# EAGLE design imsensor-esp-v01 (EAGLE 7.5.0)
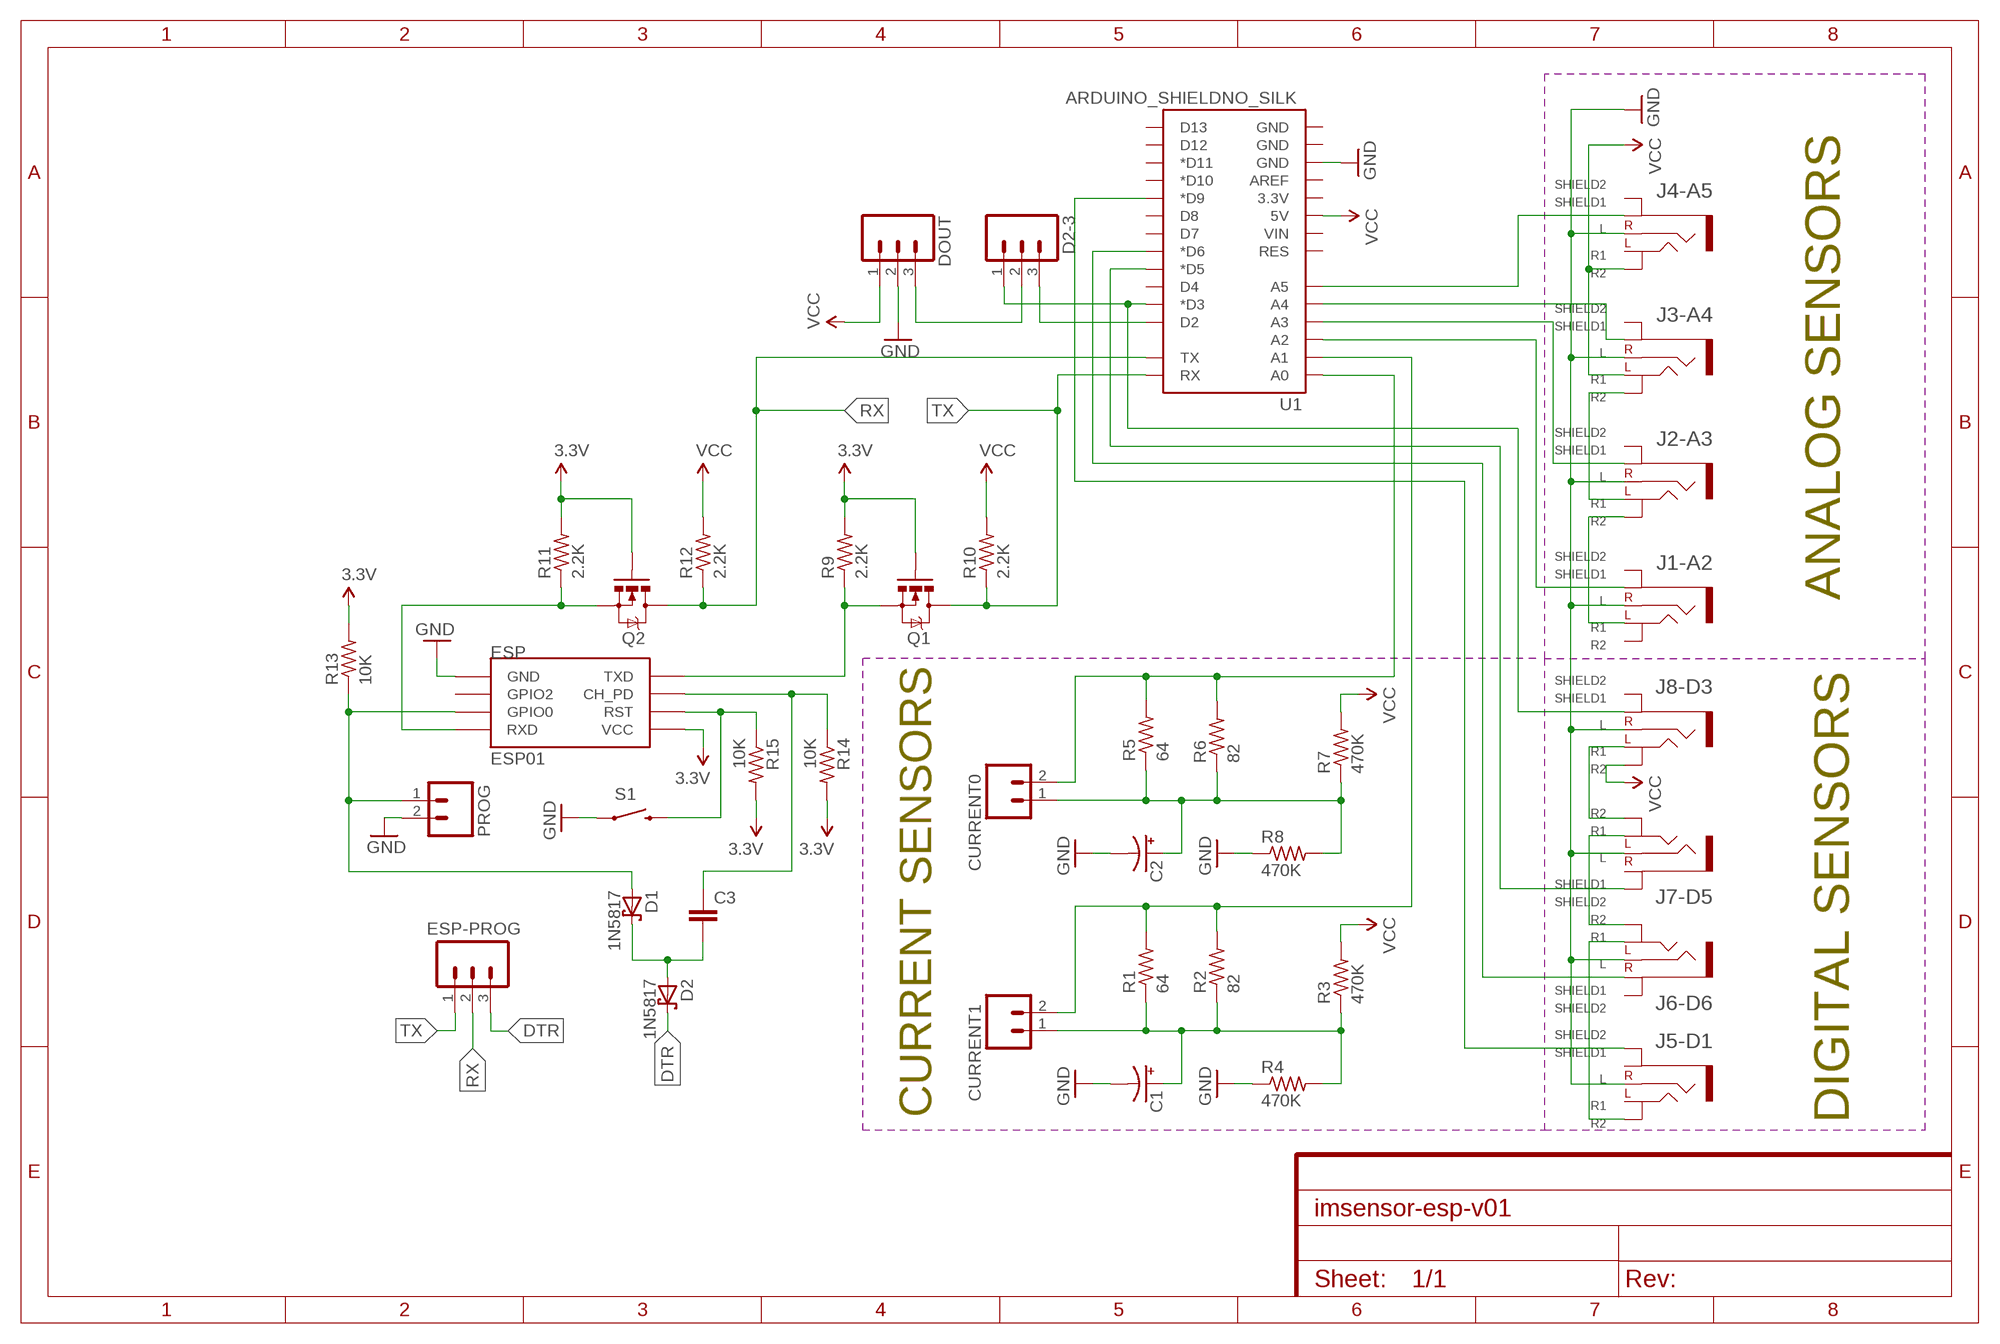
[diagram p0: schematic, sheet 1]
FRAME1 (FRAME-A4L): CNAME: IMSensorNode; CREVISION: REV A; DESIGNER: Jeferson Lima

## Parts
C1  10UF-25V-20%(PTH)  [CPOL-RADIAL-10UF-25V]
C2  10UF-25V-20%(PTH)  [CPOL-RADIAL-10UF-25V]
C3  CAPPTH  [CAP-PTH-SMALL]
CURRENT0  M02PTH  [1X02]
CURRENT1  M02PTH  [1X02]
D1  1N5817  SCHOTTKY-DIODEDO35-7  [DO35-7]
D2  1N5817  SCHOTTKY-DIODEDO35-7  [DO35-7]
D2-3  M03PTH  [1X03]
DOUT  M03PTH  [1X03]
ESP  ESP01  [ESP01]
ESP-PROG  M03PTH  [1X03]
J1-A2  PJ-313-SPAD  [PJ-313-5PIN-SMALL]
J2-A3  PJ-313-SPAD  [PJ-313-5PIN-SMALL]
J3-A4  PJ-313-SPAD  [PJ-313-5PIN-SMALL]
J4-A5  PJ-313-SPAD  [PJ-313-5PIN-SMALL]
J5-D1  PJ-313-SPAD  [PJ-313-5PIN-SMALL]
J6-D6  PJ-313-SPAD  [PJ-313-5PIN-SMALL]
J7-D5  PJ-313-SPAD  [PJ-313-5PIN-SMALL]
J8-D3  PJ-313-SPAD  [PJ-313-5PIN-SMALL]
PROG  M02PTH  [1X02]
Q1  MOSFET-NCHANNEL2N7000  [TO-92]
Q2  MOSFET-NCHANNEL2N7000  [TO-92]
R1  64  R-US_0207/10  [0207/10]
R2  82  R-US_0207/10  [0207/10]
R3  470K  R-US_0207/10  [0207/10]
R4  470K  R-US_0207/10  [0207/10]
R5  64  R-US_0207/10  [0207/10]
R6  82  R-US_0207/10  [0207/10]
R7  470K  R-US_0207/10  [0207/10]
R8  470K  R-US_0207/10  [0207/10]
R9  2.2K  R-US_0207/10  [0207/10]
R10  2.2K  R-US_0207/10  [0207/10]
R11  2.2K  R-US_0207/10  [0207/10]
R12  2.2K  R-US_0207/10  [0207/10]
R13  10K  R-US_0207/10  [0207/10]
R14  10K  R-US_0207/10  [0207/10]
R15  10K  R-US_0207/10  [0207/10]
S1  SWITCH-MOMENTARY-2PTH  [TACTILE-PTH]
U1  ARDUINO_SHIELDNO_SILK  [DUEMILANOVE_VIAS]

## Nets
3.3V: ESP.VCC Q1.2(G) Q2.2(G) R9.2 R11.2 R13.2 R14.2 R15.2
DEK: CURRENT0.2 R5.2 R6.2 U1.A0
DTR: D2.C ESP-PROG.3
GND: C1.2(-) C2.2(-) DOUT.2 ESP.GND J1-A2.2(R) J2-A3.2(R) J3-A4.2(R) J4-A5.2(R) J5-D1.2(R) J6-D6.2(R) J7-D5.2(R) J8-D3.2(R) PROG.2 R4.1 R8.1 S1.1 U1.GND@2(GND)
J5: J6-D6.1.1(SHIELD1) U1.D6(*D6)
N$1: J2-A3.3.1(L1) J3-A4.3.2(L2)
N$2: J1-A2.3.1(L1) J2-A3.3.2(L2)
N$3: J3-A4.1.1(SHIELD1) U1.A4
N$4: J2-A3.1.1(SHIELD1) U1.A3
N$5: J1-A2.1.1(SHIELD1) U1.A2
N$6: J7-D5.1.2(SHIELD2) U1.D5(*D5)
N$7: J7-D5.3.2(L2) J8-D3.3.1(L1)
N$8: D2-3.2 DOUT.3
N$9: J6-D6.3.2(L2) J7-D5.3.1(L1)
N$10: CURRENT1.2 R1.2 R2.2 U1.A1
N$11: C1.1(+) CURRENT1.1 R1.1 R2.1 R3.1 R4.2
N$12: J5-D1.1.2(SHIELD2) U1.D9(*D9)
N$13: D2-3.1 J8-D3.1.1(SHIELD1) U1.D3(*D3)
N$14: D2-3.3 U1.D2
N$15: J4-A5.1.1(SHIELD1) U1.A5
N$16: J5-D1.3.2(L2) J6-D6.3.1(L1)
N$17: C2.1(+) CURRENT0.1 R5.1 R6.1 R7.1 R8.2
N$18: ESP.TX(TXD) Q1.1(S) R9.1
N$20: ESP.RST R15.1 S1.3
N$21: ESP.RX(RXD) Q2.1(S) R11.1
N$22: C3.1 ESP.CH_PD R14.1
N$25: D1.A ESP.GPIO0 PROG.1 R13.1
RX: ESP-PROG.2 Q2.3(D) R12.1 U1.TX
TX: ESP-PROG.1 Q1.3(D) R10.1 U1.RX
U$1: C3.2 D1.C D2.A
VCC: DOUT.1 J3-A4.3.1(L1) J4-A5.3.2(L2) J8-D3.3.2(L2) R3.2 R7.2 R10.2 R12.2 U1.5V
Unconnected: ESP.GPIO2 J1-A2.1.2(SHIELD2) J1-A2.3.2(L2) J2-A3.1.2(SHIELD2) J3-A4.1.2(SHIELD2) J4-A5.1.2(SHIELD2) J4-A5.3.1(L1) J5-D1.1.1(SHIELD1) J5-D1.3.1(L1) J6-D6.1.2(SHIELD2) J7-D5.1.1(SHIELD1) J8-D3.1.2(SHIELD2) U1.3.3V U1.AREF U1.D4 U1.D7 U1.D8 U1.D10(*D10) U1.D11(*D11) U1.D12 U1.D13 U1.GND@0(GND) U1.GND@1(GND) U1.RES U1.VIN

## Notes on the sheet
- ANALOG SENSORS
- CURRENT SENSORS | DIGITAL SENSORS

## Library data of the parts
C1 C2 = SparkFun-Capacitors:10UF-25V-20%(PTH): CAP-08440; PROD_ID: CAP-08440
C3 = SparkFun-Capacitors:CAP: Capacitor Standard 0603 ceramic capacitor, and 0.1" leaded capacitor.
CURRENT0 CURRENT1 PROG = SparkFun-Connectors:M02: Standard 2-pin 0.1" header. Use with - straight break away headers ( PRT-00116) - right angle break away headers (PRT-00553) - swiss pins (PRT-00743) - machine pins (PRT-00117) - female headers (PRT-00115) Molex polarized connector foot print use with: PRT-08233 with associated crimp pins and housings. 2.54_SCREWTERM for use with PRT-10571. 3.5mm Screw Terminal footprints for PRT-08084 5mm Screw Terminal footprints for use with PRT-08432
D1 D2 = adafruit:SCHOTTKY-DIODE: Schottky Diode
D2-3 DOUT ESP-PROG = SparkFun-Connectors:M03: Header 3 Standard 3-pin 0.1" header. Use with straight break away headers (SKU : PRT-00116), right angle break away headers (PRT-00553), swiss pins (PRT-00743), machine pins (PRT-00117), and female headers (PRT-00115). Molex polarized connector foot print use with SKU : PRT-08232 with associated crimp pins and housings.
ESP = esp8266-modules:ESP01: ESP8266 Wifi module 01
J1-A2 J2-A3 J3-A4 J4-A5 J5-D1 J6-D6 J7-D5 J8-D3 = salvador-parts:PJ-313-SPAD: PJ-313 with octagon pads PJ-313 with small octagon pads, good for projects which need small footprints
Q1 Q2 = SparkFun-DiscreteSemi:MOSFET-NCHANNEL: Common NMOSFET Parts MFG P/N Store ID Prod ID FDD8780 TRANS-09984 SI7820DN TRANS-11055 FDS6630A IC-08089 2N7002PW TRANS-11151 FQP30N06L COM-10213 TRANS-10060 BSS123LT1G TRANS-08345 BSS138 TRANS-00830 BS170 2N7000
R1-R15 = resistor:R-US_: RESISTOR, American symbol
S1 = SparkFun-Electromechanical:SWITCH-MOMENTARY-2: Various NO switches- pushbuttons, reed, etc; PROD_ID: SWCH-08441
U1 = SparkFun-Boards:ARDUINO_SHIELD: Arduino shield footprint

## Board
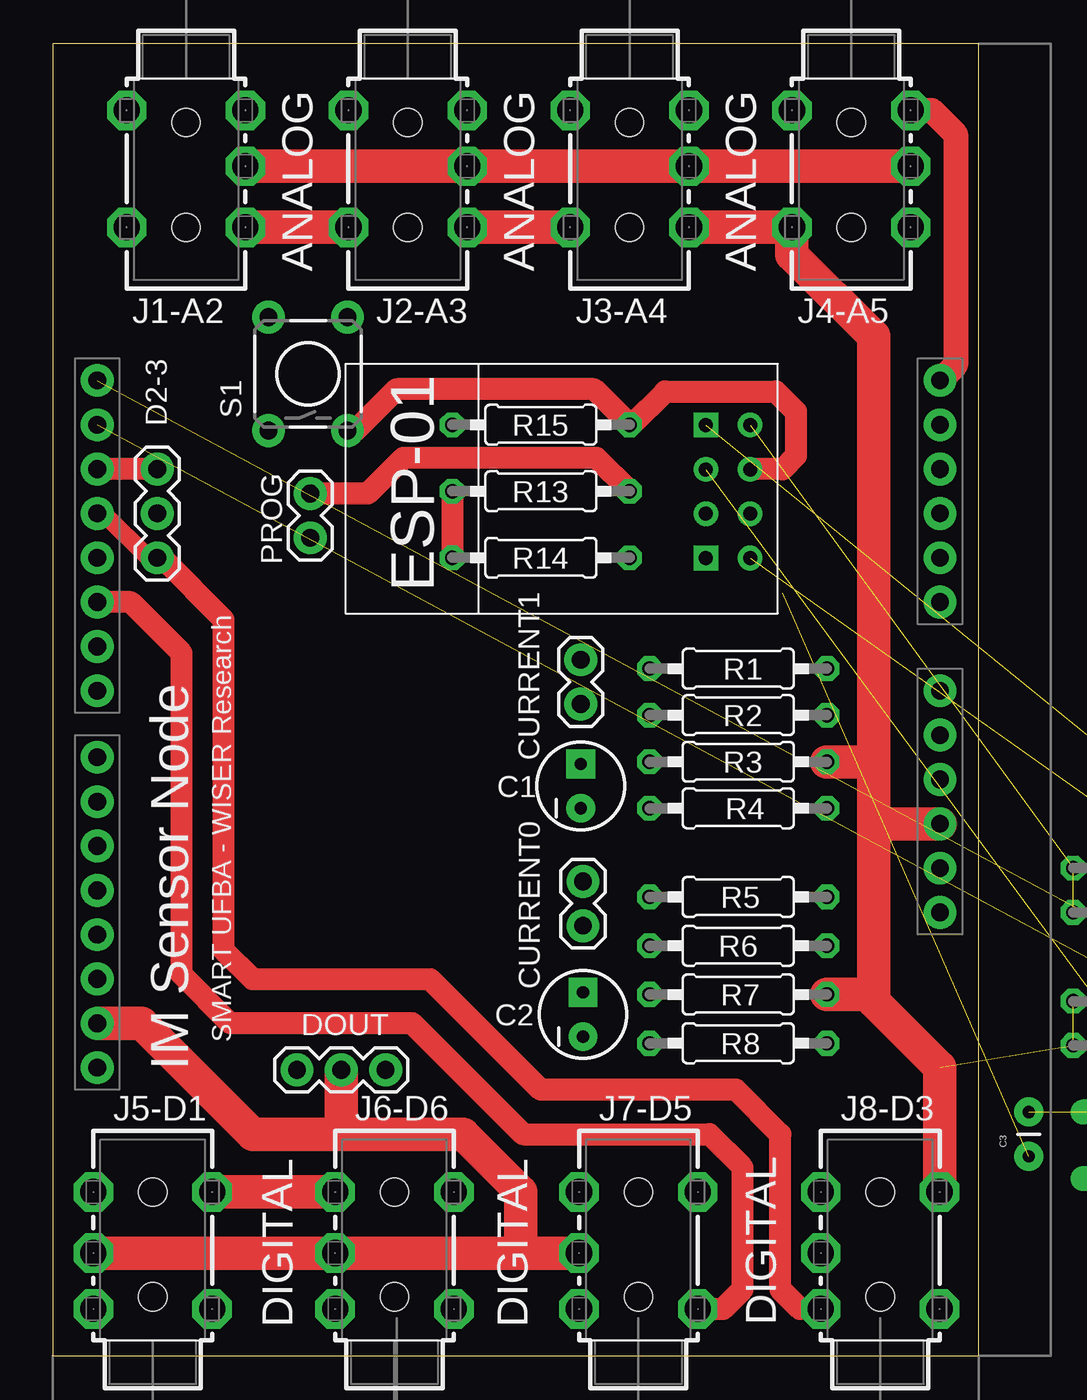
[diagram p1: board, top side]
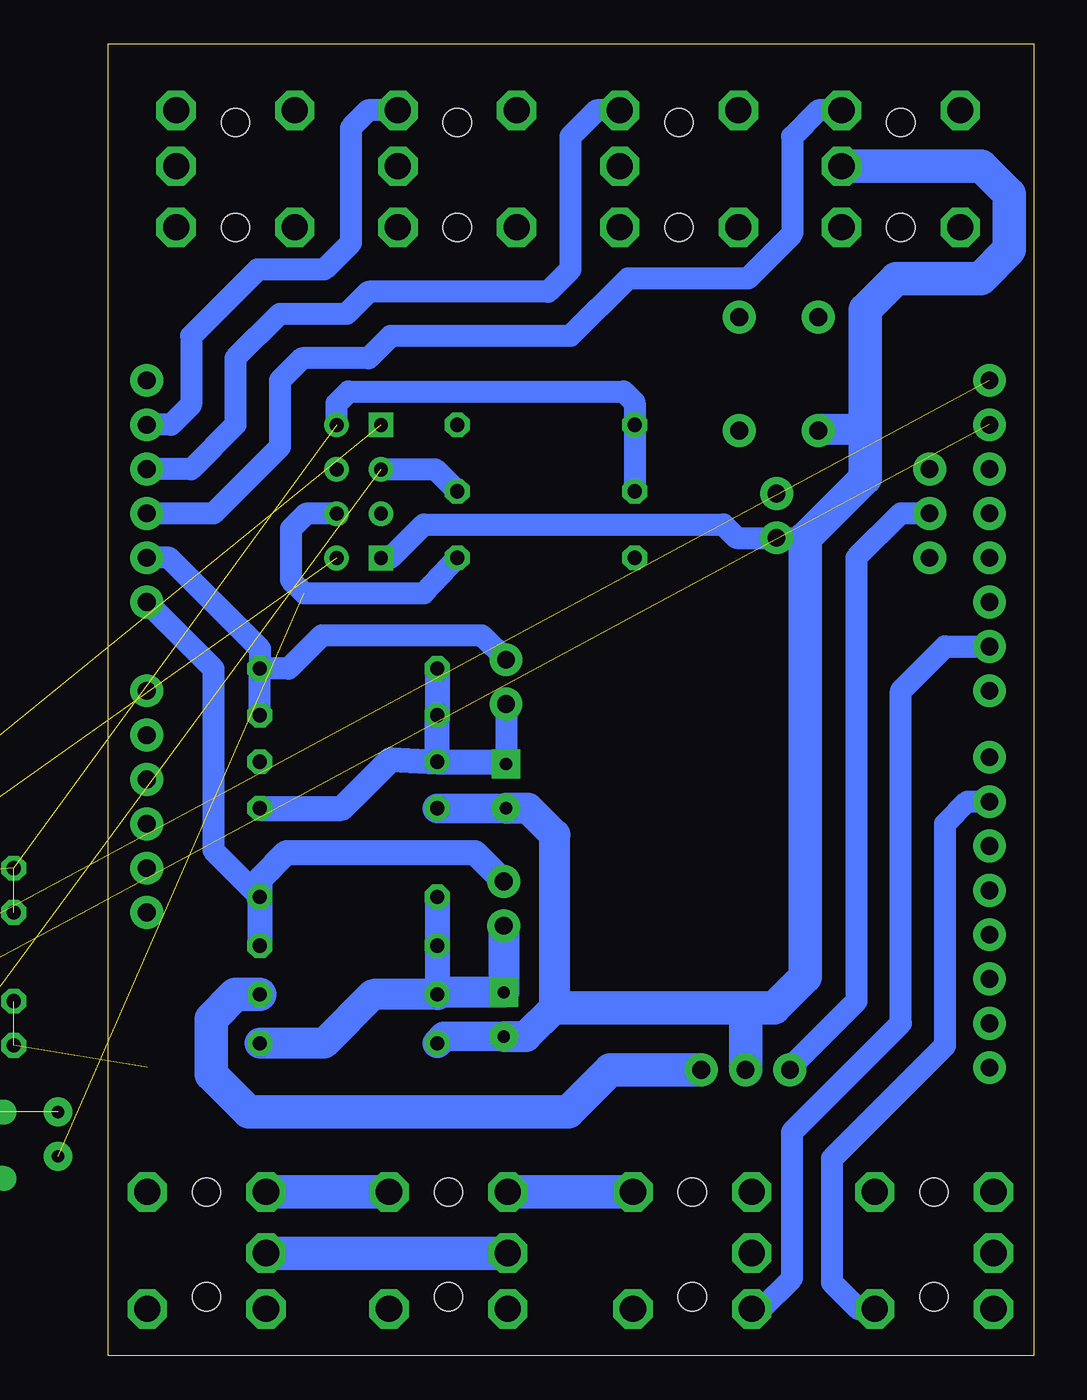
[diagram p2: board, bottom side, seen from below]

Size 53.01 x 75.17 mm. Coordinates in mm from the lower left corner, seen from the top.
Outline: 0,0 53.01,0 53.01,75.17 0,75.17 0,0
Copper layers (1*16): Top 0.035mm / dielectric 1.5mm / Bottom 0.035mm
Design rules "default": minimum track width 8mil, minimum drill 20mil, track to track 8mil, track to pad 8mil, pad to pad 8mil, via to via 8mil, smd to smd 8mil, copper to edge 10mil, drill to drill 8mil, minimum pad ring 12mil, minimum via ring 10mil, stop-mask expansion 4mil, vias tented up to drill 25mil, thermal gap 10mil

### Footprints (pad centres in the part's own frame; a part is rotated, then mirrored left to right if it is on the bottom)
CPOL-RADIAL-10UF-25V = drill 0.7 pad 1.651 square: 1 1.27,0 | drill 0.7 pad 1.651: 2 -1.27,0
CAP-PTH-SMALL = drill 0.7 pad 1.651: 1 0,0; 2 2.54,0
1X02 = drill 1.016 pad 1.88: 1 0,0; 2 2.54,0
DO35-7 = drill 0.813 long: A 3.81,0; C -3.81,0
1X03 = drill 1.016 pad 1.88: 1 0,0; 2 2.54,0; 3 5.08,0
ESP01 = drill 0.8: CH_PD -1.285,-8.178; GPIO0 1.255,-5.638; GPIO2 -1.285,-5.638; RST 1.255,-8.178; TX -3.825,-8.178; VCC 3.795,-8.178 | drill 0.8 square: GND -3.825,-5.638; RX 3.795,-5.638
PJ-313-5PIN-SMALL = drill 1.5 octagon: 1.1 1.8,3.4; 1.2 1.8,-3.4; 2 5,3.4; 3.1 8.5,3.4; 3.2 8.5,-3.4 | hole 1.6: 2.5,0; 8.5,0
TO-92 = drill 0.813 pad 1.88: 1 -1.27,0; 2 0,1.905; 3 1.27,0
0207/10 = drill 0.813 octagon: 1 -5.08,0; 2 5.08,0
TACTILE-PTH = drill 1.016 pad 1.88: 1 -3.251,2.261; 2 3.251,2.261; 3 -3.251,-2.261; 4 3.251,-2.261
DUEMILANOVE_VIAS = drill 1.016 pad 1.88: 3.3V 50.8,13.97; 5V 50.8,16.51; A0 50.8,29.21; A1 50.8,31.75; A2 50.8,34.29; A3 50.8,36.83; A4 50.8,39.37; A5 50.8,41.91; AREF 2.54,2.54; D2 2.54,36.83; D3 2.54,34.29; D4 2.54,31.75; D5 2.54,29.21; D6 2.54,26.67; D7 2.54,24.13; D8 2.54,20.32; D9 2.54,17.78; D10 2.54,15.24; D11 2.54,12.7; D12 2.54,10.16; D13 2.54,7.62; GND@0 50.8,19.05; GND@1 50.8,21.59; GND@2 2.54,5.08; RES 50.8,11.43; RX 2.54,41.91; TX 2.54,39.37; VIN 50.8,24.13

### Placement (x,y rotation side)
C1  30.23,32.64 90 top
C2  30.35,19.56 90 top
C3  55.88,11.43 90 top
CURRENT0  30.35,24.64 90 top
CURRENT1  30.23,37.34 90 top
D1  63.5,10.16 0 top  (outside the outline)
D2  63.5,13.97 180 top  (outside the outline)
D2-3  5.97,45.72 90 top
DOUT  19.05,16.38 180 top
ESP  31.75,49.53 90 top
ESP-PROG  77.47,12.7 180 top  (outside the outline)
J1-A2  7.62,73.15 270 top
J2-A3  20.32,73.15 270 top
J3-A4  33.02,73.15 270 top
J4-A5  45.72,73.15 270 top
J5-D1  5.71,0.89 90 top
J6-D6  19.56,0.89 90 top
J7-D5  33.53,0.89 90 top
J8-D3  47.37,0.89 90 top
PROG  14.73,49.4 270 top
Q1  72.39,19.05 270 top  (outside the outline)
Q2  72.39,26.67 270 top  (outside the outline)
R1  39.24,39.37 0 top
R2  39.24,36.7 0 top
R3  39.24,34.04 0 top
R4  39.24,31.37 0 top
R5  39.24,26.29 0 top
R6  39.24,23.5 0 top
R7  39.24,20.7 0 top
R8  39.24,17.91 0 top
R9  63.5,25.4 180 top  (outside the outline)
R10  63.5,20.32 180 top  (outside the outline)
R11  63.5,27.94 180 top  (outside the outline)
R12  63.5,17.78 180 top  (outside the outline)
R13  27.94,49.53 180 top
R14  27.94,45.72 180 top
R15  27.94,53.34 180 top
S1  14.61,56.26 90 top
U1  0,13.97 0 top

### Tracks (layer width: path | path; a pad name or v marks a point on that pad's centre or on a via)
3.3V  (4 unrouted)
  Top 1.27: R13.2 R14.2
  Bottom 1.27: ESP.VCC 39.93,54.56 39.24,55.24 23.5,55.24 22.86,54.61 R15.2 R13.2
DEK
  Bottom 1.27: U1.A0 46.99,39.37 46.99,28.96 R5.2
  Bottom 1.422: R6.2 R5.2 44.32,27.3 42.8,28.83 32,28.83 CURRENT0.2
DTR  (1 unrouted)
GND
  Top 1.93: J1-A2.2 J2-A3.2 J3-A4.2 J4-A5.2 | J5-D1.2 J6-D6.2 26.92,5.89 | 26.92,5.89 J7-D5.2 | DOUT.2 16.51,12.7 | 16.51,12.7 23.5,12.7 26.8,9.4 26.8,6.02 26.92,5.89 | U1.GND@2 5.08,19.05 11.43,12.7 16.51,12.7
  Bottom 1.27: ESP.GND 37.37,45.72 36.83,45.72 34.92,47.62 17.78,47.62 17.02,46.86 PROG.2 13.08,46.86
  Bottom 1.676: C2.2 33.78,18.29 R8.1 | R4.1 C1.2
  Bottom 1.778: C1.2 28.96,31.37 27.43,29.84 27.43,19.94 29.08,18.29 C2.2 | 9.65,53.09 12.27,53.09 S1.1
  Bottom 1.93: J8-D3.2 J7-D5.2 | 27.43,19.94 16.51,19.94 | 16.51,19.94 14.86,19.94 13.08,21.72 13.08,46.86 9.65,50.29 9.65,53.09 9.65,59.94 7.87,61.72 3.05,61.72 1.4,63.37 1.4,66.55 3,68.15 J1-A2.2 | DOUT.2 16.51,19.94
J5
  Bottom 1.27: U1.D6 5.08,40.64 7.62,38.1 7.62,19.05 13.84,12.83 13.84,4.45 15.6,2.69 J6-D6.1.1
N$1
  Top 1.93: J2-A3.3.1 J3-A4.3.2
N$2
  Top 1.93: J2-A3.3.2 J1-A2.3.1
N$3
  Bottom 1.27: J3-A4.1.1 38.12,71.35 39.12,70.36 39.12,63.75 40.64,62.23 44.45,62.23 48.26,58.42 48.26,54.48 49.4,53.34 U1.A4
N$4
  Bottom 1.27: J2-A3.1.1 25.04,71.35 26.54,69.85 26.54,62.23 27.81,60.96 38.1,60.96 39.37,59.69 43.18,59.69 45.72,57.15 45.72,53.34 48.26,50.8 U1.A3
N$5
  Bottom 1.27: J1-A2.1.1 12.34,71.35 13.84,69.85 13.84,64.26 16.38,61.72 23.24,61.72 26.54,58.42 36.83,58.42 38.1,57.15 41.91,57.15 43.18,55.88 43.18,52.07 46.99,48.26 U1.A2
N$6
  Top 1.27: U1.D5 4.45,43.18 7.37,40.26 7.37,21.84 10.16,19.05 20.57,19.05 26.92,12.7 37.59,12.7 39.5,10.79 39.5,3.81 38.38,2.69 J7-D5.1.2
N$7
  Bottom 1.93: J8-D3.3.1 J7-D5.3.2
N$8
  Bottom 1.27: D2-3.2 7.62,48.26 10.16,45.72 10.16,20.32 13.97,16.51 DOUT.3
N$9
  Bottom 1.93: J7-D5.3.1 J6-D6.3.2
N$10
  Bottom 1.27: R2.2 R1.2 | CURRENT1.2 31.62,41.27 40.77,41.27 42.67,39.37 R1.2 | U1.A1 49.53,45.72 44.32,40.51 R1.2
N$11
  Bottom 1.27: CURRENT1.1 30.23,34.04
  Bottom 1.422: R4.2 39.62,31.37 36.83,34.16 R3.1 | R3.1 R2.1 R1.1 | R3.1 30.23,34.04 C1.1
N$12
  Bottom 1.27: U1.D9 3.81,31.75 5.08,30.48 5.08,17.78 11.56,11.3 11.56,4.19 10.05,2.69 J5-D1.1.2
N$13
  Top 1.016: U1.D3 2.92,48.26 5.46,45.72 D2-3.1
  Top 1.27: J8-D3.1.1 42.78,2.69 41.66,3.81 41.66,12.7 39.12,15.24 27.94,15.24 21.59,21.59 11.43,21.59 9.78,23.24 9.78,42.16 6.22,45.72 D2-3.1
N$14
  Top 1.27: D2-3.3 U1.D2
N$15
  Top 1.422: J4-A5.1.1 50.31,71.35 51.69,69.98 51.69,56.77 U1.A5
N$16
  Top 1.93: J5-D1.3.2 J6-D6.3.1
N$17
  Bottom 1.422: R5.1 R6.1 34.16,20.83
  Bottom 1.778: R8.2 40.64,17.91 37.85,20.7 R7.1 34.16,20.83 C2.1 CURRENT0.1
N$18  (2 unrouted)
N$20
  Top 1.27: ESP.RST 39.94,50.8 41.78,50.8 42.55,51.56 42.55,54.1 41.4,55.24 35.05,55.24 33.15,53.34 R15.1 30.99,55.37 19.68,55.37 17.37,53.06 S1.3
N$21  (2 unrouted)
N$22  (1 unrouted)
  Bottom 1.27: ESP.CH_PD 41.67,48.24 42.55,47.37 42.55,44.45 41.78,43.69 34.92,43.69 R14.1
N$25  (1 unrouted)
  Top 1.27: R13.1 31.11,51.44 20.07,51.44 18.03,49.4 PROG.1
  Bottom 1.27: R13.1 34.29,50.8 37.37,50.8 ESP.GPIO0
RX  (3 unrouted)
TX  (3 unrouted)
U$1  (2 unrouted)
VCC  (2 unrouted)
  Top 1.93: J3-A4.3.1 J4-A5.3.2 42.32,63.09 46.99,58.42 46.99,34.04 | 46.99,34.04 46.99,30.48 | U1.5V 46.99,30.48 | J8-D3.3.2 50.77,16.54 46.99,20.32 46.99,20.7 | R3.2 46.99,34.04 | 46.99,30.48 46.99,20.7 | R7.2 46.99,20.7
  Bottom 1.93: DOUT.1 24.26,16.38 26.67,13.97 44.96,13.97 47.12,16.13 47.12,19.3 45.72,20.7 R7.2

### Text on the board
tPlace: ANALOG | ANALOG | ANALOG | SMART UFBA - WISER Research | IM Sensor Node | DIGITAL | DIGITAL | DIGITAL